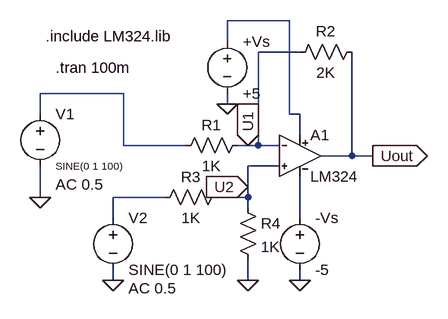
[diagram p0: schematic 2_1_d.asc]
2_1_d.asc, the LTspice schematic file:
Version 4.1
SHEET 1 880 680
WIRE 304 -64 208 -64
WIRE 208 -32 208 -64
WIRE 320 -16 256 -16
WIRE 48 48 -80 48
WIRE 208 64 208 48
WIRE -80 80 -80 48
WIRE 304 80 304 -64
WIRE 320 80 304 80
WIRE 320 112 320 80
WIRE 48 128 48 48
WIRE 144 128 48 128
WIRE 240 128 224 128
WIRE 256 128 256 -16
WIRE 256 128 240 128
WIRE 288 128 256 128
WIRE 400 144 400 -16
WIRE 400 144 352 144
WIRE 432 144 400 144
WIRE 288 160 240 160
WIRE 240 192 240 160
WIRE -80 208 -80 160
WIRE 112 208 32 208
WIRE 240 208 240 192
WIRE 240 208 192 208
WIRE 240 224 240 208
WIRE 32 240 32 208
WIRE 320 240 320 176
WIRE 32 336 32 320
WIRE 240 336 240 304
WIRE 320 336 320 320
FLAG 240 336 0
FLAG 208 64 0
FLAG 320 336 0
FLAG 240 128 U1
IOPIN 240 128 In
FLAG 432 144 Uout
IOPIN 432 144 Out
FLAG -80 208 0
FLAG 32 336 0
FLAG 240 192 U2
IOPIN 240 192 In
SYMBOL LM324 320 144 R0
SYMATTR InstName Α1
SYMBOL res 240 112 R90
WINDOW 0 0 56 VBottom 2
WINDOW 3 32 56 VTop 2
SYMATTR InstName R1
SYMATTR Value 1K
SYMATTR SpiceLine tol=1 pwr=0.1
SYMBOL res 416 -32 R90
WINDOW 0 0 56 VBottom 2
WINDOW 3 32 56 VTop 2
SYMATTR InstName R2
SYMATTR Value 2K
SYMATTR SpiceLine tol=1 pwr=0.1
SYMBOL voltage 208 -48 R0
WINDOW 123 0 0 Left 0
WINDOW 39 0 0 Left 0
SYMATTR InstName +Vs
SYMATTR Value +5
SYMBOL voltage 320 224 R0
WINDOW 123 0 0 Left 0
WINDOW 39 0 0 Left 0
SYMATTR InstName -Vs
SYMATTR Value -5
SYMBOL voltage -80 64 R0
WINDOW 123 24 124 Left 2
WINDOW 39 0 0 Left 0
WINDOW 3 24 96 Left 1
SYMATTR Value2 AC 0.5
SYMATTR InstName V1
SYMATTR Value SINE(0 1 100)
SYMBOL res 208 192 R90
WINDOW 0 0 56 VBottom 2
WINDOW 3 32 56 VTop 2
SYMATTR InstName R3
SYMATTR Value 1K
SYMATTR SpiceLine tol=1 pwr=0.1
SYMBOL res 224 208 R0
SYMATTR InstName R4
SYMATTR Value 1K
SYMATTR SpiceLine tol=1 pwr=0.1
SYMBOL voltage 32 224 R0
WINDOW 123 24 124 Left 2
WINDOW 39 0 0 Left 0
SYMATTR InstName V2
SYMATTR Value SINE(0 1 100)
SYMATTR Value2 AC 0.5
TEXT -72 -40 Left 2 !.include LM324.lib
TEXT -56 8 Left 2 !.tran 100m

The netlist it stands for:
* 2_1_d.asc
X§Α1 U2 U1 N001 N004 Uout LM324  ; pins In+ In- V+ V- OUT
R1 U1 N002 1K tol=1 pwr=0.1
R2 Uout U1 2K tol=1 pwr=0.1
V§+Vs N001 0 +5
V§-Vs N004 0 -5
V1 N002 0 SINE(0 1 100) AC 0.5
R3 U2 N003 1K tol=1 pwr=0.1
R4 U2 0 1K tol=1 pwr=0.1
V2 N003 0 SINE(0 1 100) AC 0.5
.include LM324.lib
.tran 100m
.backanno
.end